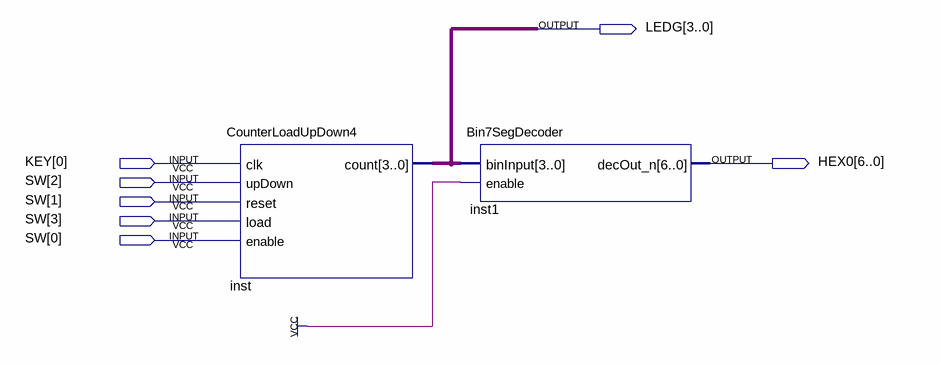
[diagram p0: schematic sheet]
// Quartus schematic Counter_Demo.bdf as structural Verilog: 2 symbols, 7 pins
module Counter_Demo (
  input  [0:0] KEY,
  input  [3:0] SW,
  output [3:0] LEDG,
  output [6:0] HEX0
);

  CounterLoadUpDown4 inst (.clk(KEY[0]), .upDown(SW[2]), .reset(SW[1]), .load(SW[3]), .enable(SW[0]), .count(LEDG));
  Bin7SegDecoder inst1 (.binInput(LEDG), .enable(1'b1), .decOut_n(HEX0));
endmodule
